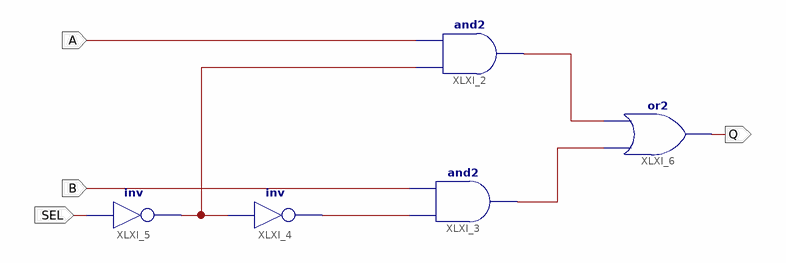
[diagram p0: schematic sheet 1]
// Xilinx ISE schematic data_selector.sch (spartan6) as structural Verilog: 5 symbols, 4 ports
module data_selector (
  input  B,
  input  A,
  input  SEL,
  output Q
);

  wire XLXN_2, XLXN_5, XLXN_6, XLXN_7;

  and XLXI_2 (XLXN_5, XLXN_7, A);
  and XLXI_3 (XLXN_6, XLXN_2, B);
  not XLXI_4 (XLXN_2, XLXN_7);
  not XLXI_5 (XLXN_7, SEL);
  or XLXI_6 (Q, XLXN_6, XLXN_5);
endmodule
